# EAGLE schematic A13-OLinuXino-MICRO_Rev_B (EAGLE 6.4)
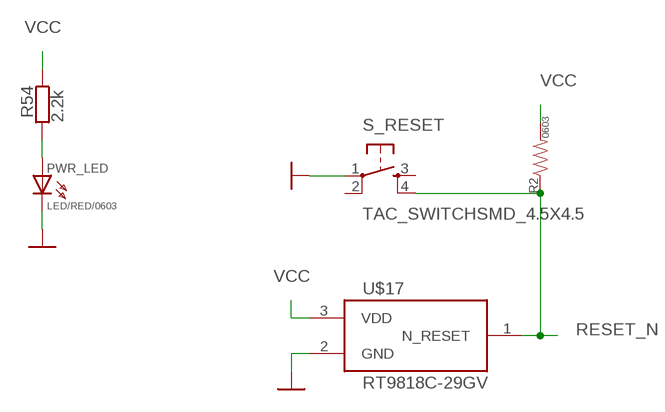
[diagram p0: schematic, sheet 1, part 1 of 3]
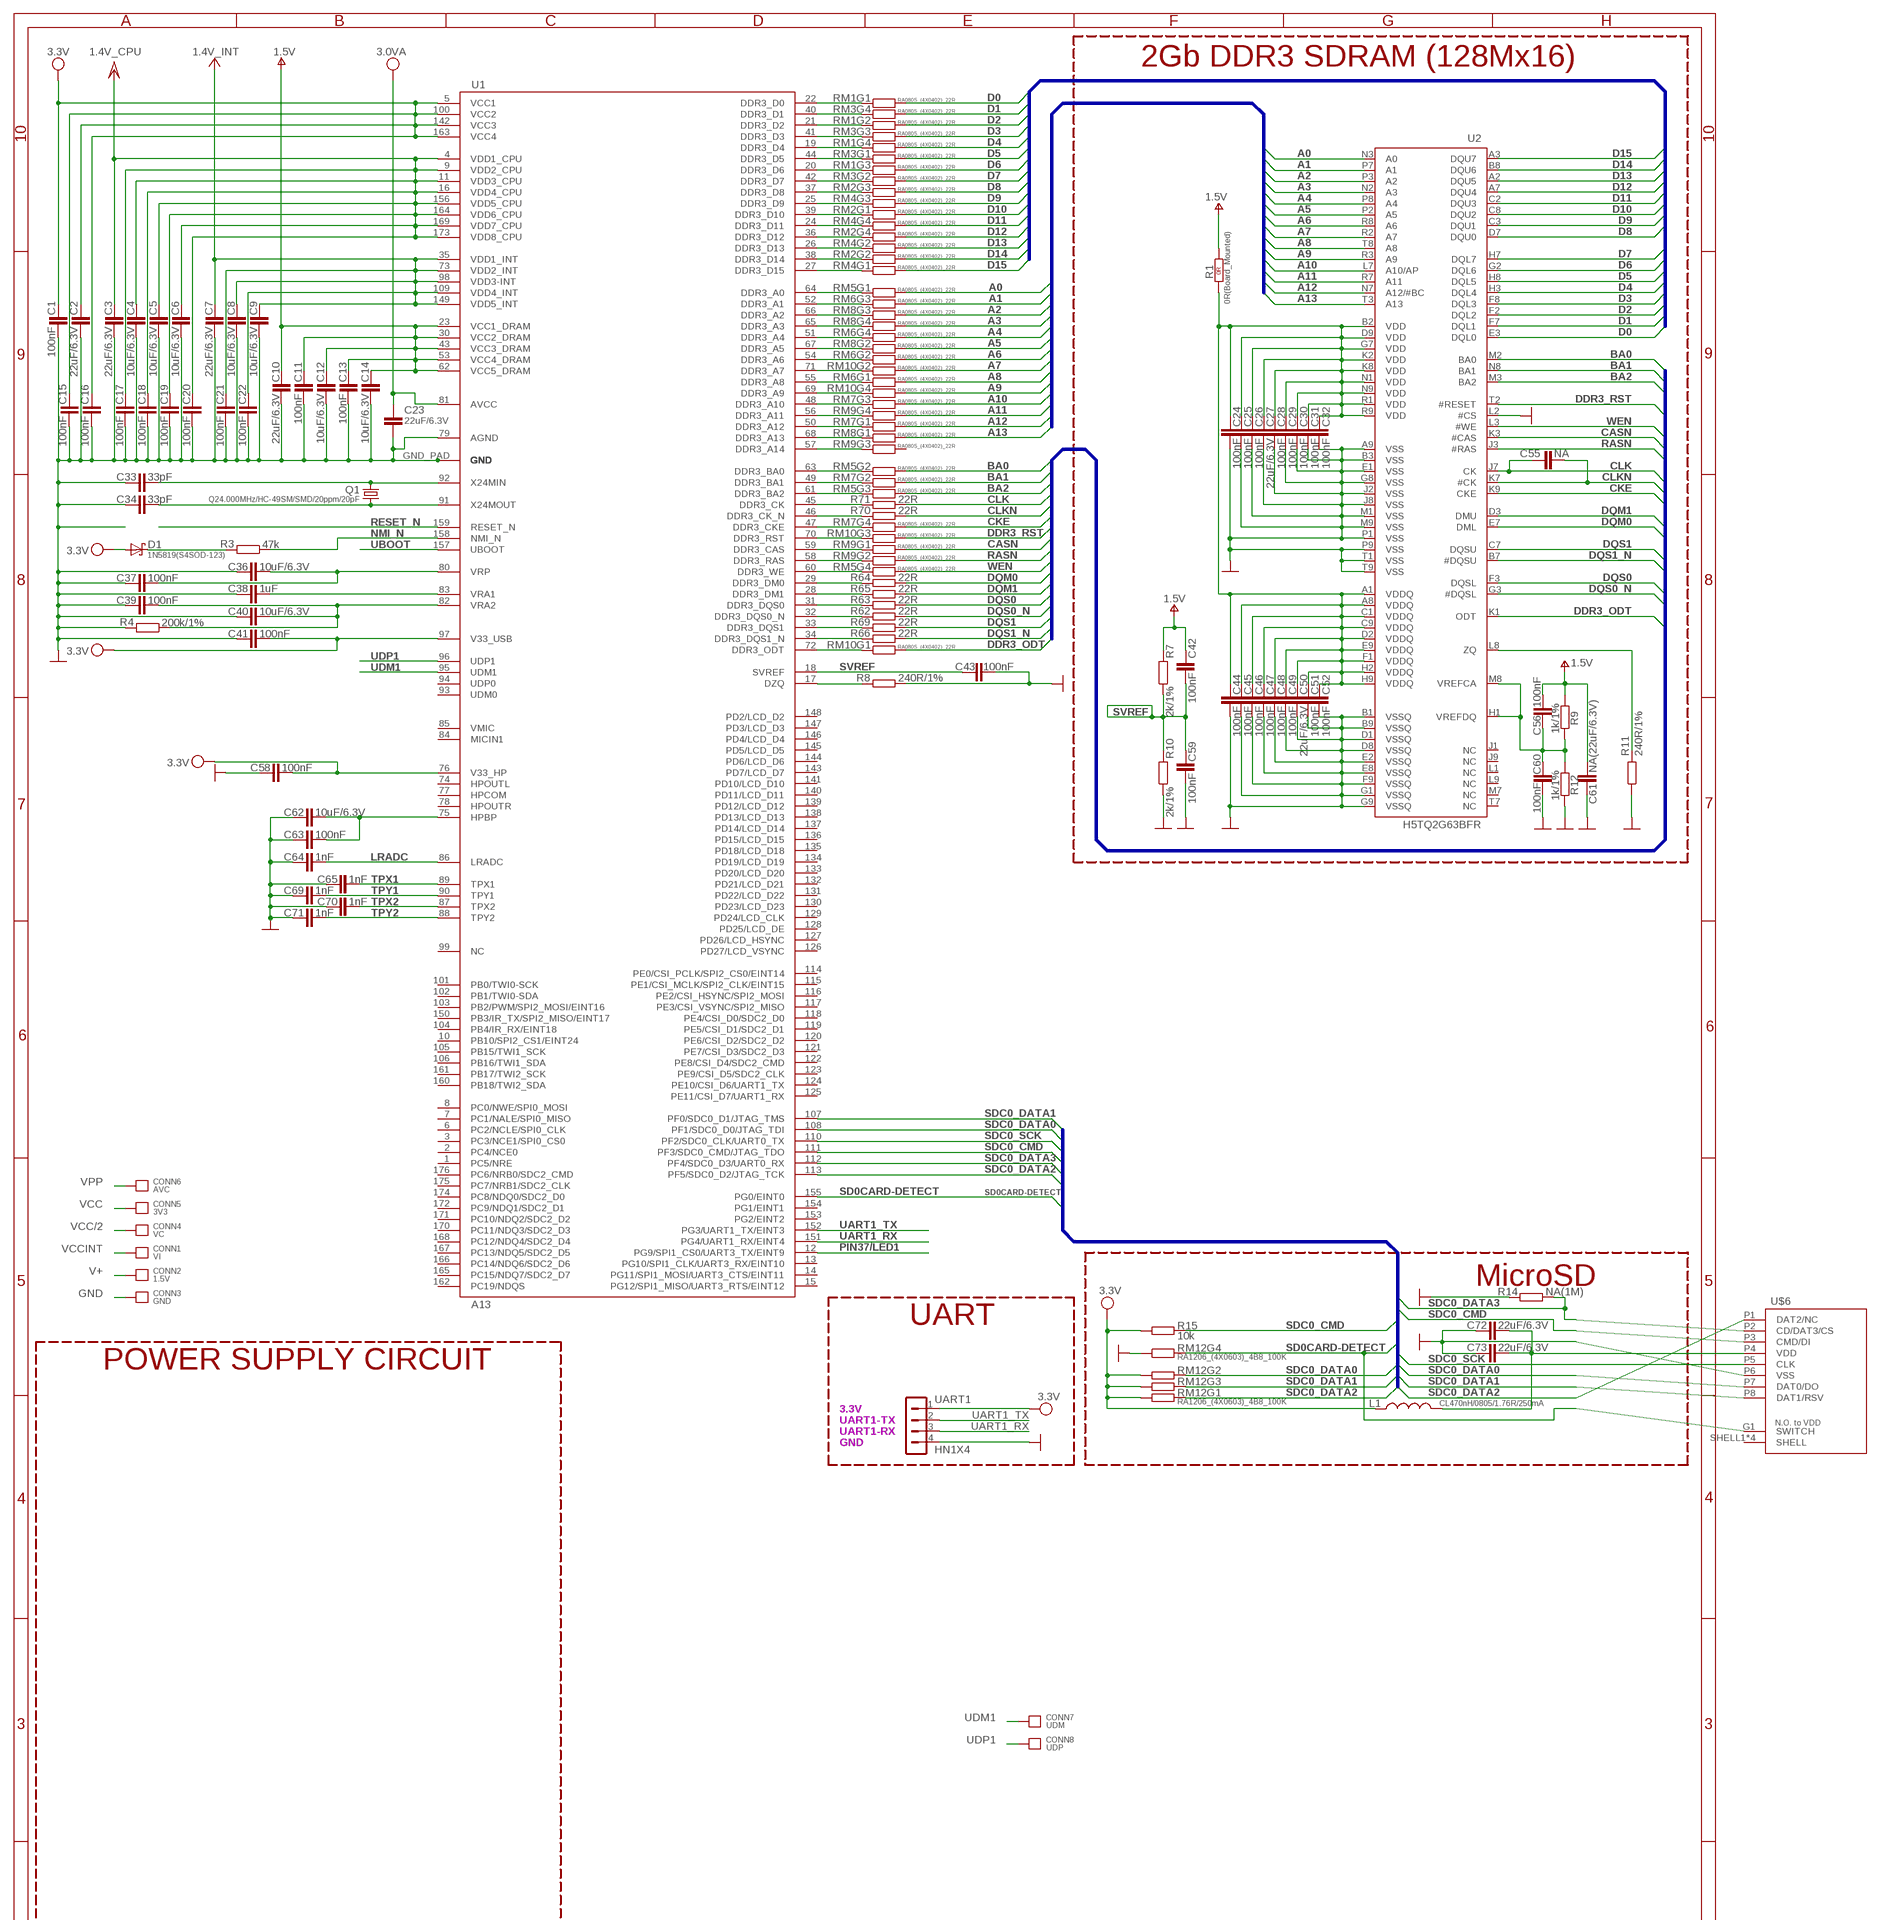
[diagram p1: schematic, sheet 1, part 2 of 3]
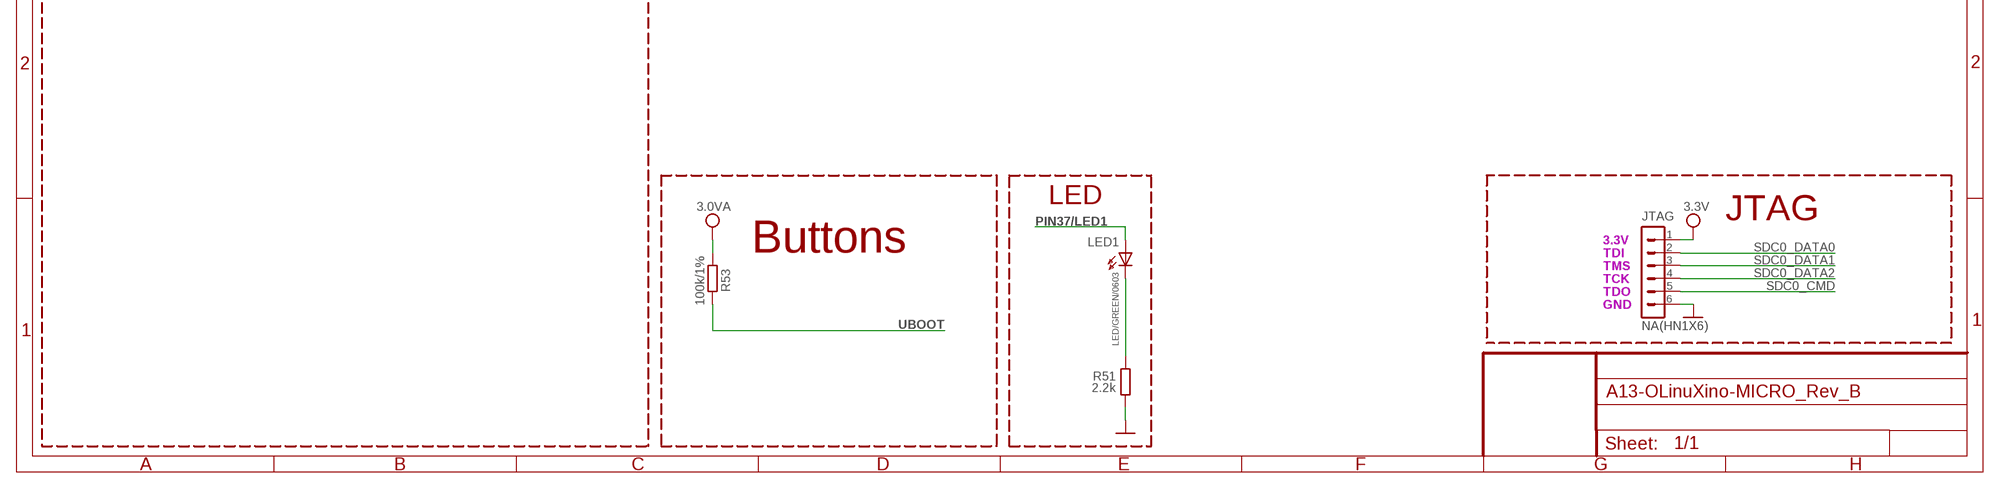
[diagram p2: schematic, sheet 1, part 3 of 3]

## Parts
C1  100nF  C-EUC0402  [C0402]
C2  22uF/6.3V  C-EUC0603_DWS  [C0603_DWS]
C3  22uF/6.3V  C-EUC0603_DWS  [C0603_DWS]
C4  10uF/6.3V  C-EUC0603_DWS  [C0603_DWS]
C5  10uF/6.3V  C-EUC0603_DWS  [C0603_DWS]
C6  10uF/6.3V  C-EUC0603_DWS  [C0603_DWS]
C7  22uF/6.3V  C-EUC0603_DWS  [C0603_DWS]
C8  10uF/6.3V  C-EUC0603_DWS  [C0603_DWS]
C9  10uF/6.3V  C-EUC0603_DWS  [C0603_DWS]
C10  22uF/6.3V  C-EUC0603_DWS  [C0603_DWS]
C11  100nF  C-EUC0402  [C0402]
C12  10uF/6.3V  C-EUC0603_DWS  [C0603_DWS]
C13  100nF  C-EUC0402  [C0402]
C14  10uF/6.3V  C-EUC0603_DWS  [C0603_DWS]
C15  100nF  C-EUC0402  [C0402]
C16  100nF  C-EUC0402  [C0402]
C17  100nF  C-EUC0402  [C0402]
C18  100nF  C-EUC0402  [C0402]
C19  100nF  C-EUC0402  [C0402]
C20  100nF  C-EUC0402  [C0402]
C21  100nF  C-EUC0402  [C0402]
C22  100nF  C-EUC0402  [C0402]
C23  22uF/6.3V  C-EUC0603_DWS  [C0603_DWS]
C24  100nF  C-EUC0402  [C0402]
C25  100nF  C-EUC0402  [C0402]
C26  100nF  C-EUC0402  [C0402]
C27  22uF/6.3V  C-EUC0603_DWS  [C0603_DWS]
C28  100nF  C-EUC0402  [C0402]
C29  100nF  C-EUC0402  [C0402]
C30  100nF  C-EUC0402  [C0402]
C31  100nF  C-EUC0402  [C0402]
C32  100nF  C-EUC0402  [C0402]
C33  33pF  C-EUC0402  [C0402]
C34  33pF  C-EUC0402  [C0402]
C36  10uF/6.3V  C-EUC0603_DWS  [C0603_DWS]
C37  100nF  C-EUC0402  [C0402]
C38  1uF  C-EUC0402  [C0402]
C39  100nF  C-EUC0402  [C0402]
C40  10uF/6.3V  C-EUC0603_DWS  [C0603_DWS]
C41  100nF  C-EUC0402  [C0402]
C42  100nF  C-EUC0402  [C0402]
C43  100nF  C-EUC0402  [C0402]
C44  100nF  C-EUC0402  [C0402]
C45  100nF  C-EUC0402  [C0402]
C46  100nF  C-EUC0402  [C0402]
C47  100nF  C-EUC0402  [C0402]
C48  100nF  C-EUC0402  [C0402]
C49  100nF  C-EUC0402  [C0402]
C50  22uF/6.3V  C-EUC0603_DWS  [C0603_DWS]
C51  100nF  C-EUC0402  [C0402]
C52  100nF  C-EUC0402  [C0402]
C55  NA  C-EUC0603_DWS  [C0603_DWS]
C56  100nF  C-EUC0402  [C0402]
C58  100nF  C-EUC0402  [C0402]
C59  100nF  C-EUC0402  [C0402]
C60  100nF  C-EUC0402  [C0402]
C61  NA(22uF/6.3V)  C-EUC0603_DWS  [C0603_DWS]
C62  10uF/6.3V  C-EUC0603_DWS  [C0603_DWS]
C63  100nF  C-EUC0402  [C0402]
C64  1nF  C-EUC0402  [C0402]
C65  1nF  C-EUC0402  [C0402]
C69  1nF  C-EUC0402  [C0402]
C70  1nF  C-EUC0402  [C0402]
C71  1nF  C-EUC0402  [C0402]
C72  22uF/6.3V  C-EUC0603_DWS  [C0603_DWS]
C73  22uF/6.3V  C-EUC0603_DWS  [C0603_DWS]
CONN1  VI  CONNECTOR22AWG  [HOLE_22AWG]
CONN2  1.5V  CONNECTOR22AWG  [HOLE_22AWG]
CONN3  GND  CONNECTOR22AWG  [HOLE_22AWG]
CONN4  VC  CONNECTOR22AWG  [HOLE_22AWG]
CONN5  3V3  CONNECTOR22AWG  [HOLE_22AWG]
CONN6  AVC  CONNECTOR22AWG  [HOLE_22AWG]
CONN7  UDM  CONNECTOR22AWG  [HOLE_22AWG]
CONN8  UDP  CONNECTOR22AWG  [HOLE_22AWG]
D1  1N5819(S4SOD-123)  SCHOTKKY7.62SS-1N5819(S4SOD-123)  [SOD-123]
JTAG  NA(HN1X6)  CON6HN1X6  [HN1X6]
L1  CL470nH/0805/1.76R/250mA  L-USL0805_5MIL_DWS  [L0805_5MIL_DWS]
LED1  LED/GREEN/0603  LED0603DWS  [LED-0603]
PWR_LED  LED/RED/0603  LED0603DWS  [LED-0603]
Q1  Q24.000MHz/HC-49SM/SMD/20ppm/20pF  HC49/S1  [HC49/SMD2_THIN]
R1  0R(Board_Mounted)  R_0R0R(NA)  [0603_0R]
R2  RESISTOR0603  [0603-RES]
R3  47k  R-EU_R0603_5MIL_DWS  [R0603_5MIL_DWS]
R4  200k/1%  R-EU_R0603_5MIL_DWS  [R0603_5MIL_DWS]
R7  2k/1%  R-EU_R0603_5MIL_DWS  [R0603_5MIL_DWS]
R8  240R/1%  R-EU_R0603_5MIL_DWS  [R0603_5MIL_DWS]
R9  1k/1%  R-EU_R0603_5MIL_DWS  [R0603_5MIL_DWS]
R10  2k/1%  R-EU_R0603_5MIL_DWS  [R0603_5MIL_DWS]
R11  240R/1%  R-EU_R0603_5MIL_DWS  [R0603_5MIL_DWS]
R12  1k/1%  R-EU_R0603_5MIL_DWS  [R0603_5MIL_DWS]
R14  NA(1M)  R-EU_R0603_5MIL_DWS  [R0603_5MIL_DWS]
R15  10k  R-EU_R0603_5MIL_DWS  [R0603_5MIL_DWS]
R51  2.2k  R-EU_R0603_5MIL_DWS  [R0603_5MIL_DWS]
R53  100k/1%  R-EU_R0603_5MIL_DWS  [R0603_5MIL_DWS]
R54  2.2k  R-EU_R0603_5MIL_DWS  [R0603_5MIL_DWS]
R62  22R  R-EU_R0603_5MIL_DWS  [R0603_5MIL_DWS]
R63  22R  R-EU_R0603_5MIL_DWS  [R0603_5MIL_DWS]
R64  22R  R-EU_R0603_5MIL_DWS  [R0603_5MIL_DWS]
R65  22R  R-EU_R0603_5MIL_DWS  [R0603_5MIL_DWS]
R66  22R  R-EU_R0603_5MIL_DWS  [R0603_5MIL_DWS]
R69  22R  R-EU_R0603_5MIL_DWS  [R0603_5MIL_DWS]
R70  22R  R-EU_R0603_5MIL_DWS  [R0603_5MIL_DWS]
R71  22R  R-EU_R0603_5MIL_DWS  [R0603_5MIL_DWS]
RM1  RA0805_(4X0402)_22R  R_MATRIX_4E_25X625  [R_MATRIX_4_0402_25X625]
RM2  RA0805_(4X0402)_22R  R_MATRIX_4E_25X625  [R_MATRIX_4_0402_25X625]
RM3  RA0805_(4X0402)_22R  R_MATRIX_4E_25X625  [R_MATRIX_4_0402_25X625]
RM4  RA0805_(4X0402)_22R  R_MATRIX_4E_25X625  [R_MATRIX_4_0402_25X625]
RM5  RA0805_(4X0402)_22R  R_MATRIX_4E_25X625  [R_MATRIX_4_0402_25X625]
RM6  RA0805_(4X0402)_22R  R_MATRIX_4E_25X625  [R_MATRIX_4_0402_25X625]
RM7  RA0805_(4X0402)_22R  R_MATRIX_4E_25X625  [R_MATRIX_4_0402_25X625]
RM8  RA0805_(4X0402)_22R  R_MATRIX_4E_25X625  [R_MATRIX_4_0402_25X625]
RM9  RA0805_(4X0402)_22R  R_MATRIX_4E_25X625  [R_MATRIX_4_0402_25X625]
RM10  RA0805_(4X0402)_22R  R_MATRIX_4E_25X625  [R_MATRIX_4_0402_25X625]
RM12  RA1206_(4X0603)_4B8_100K  R_MATRIX_4E  [R_MATRIX_4]
S_RESET  TAC_SWITCHSMD_4.5X4.5  [TAC_SWITCH_SMD_4.5X4.5]
U1  A13  [TQFP176]
U2  H5TQ2G63BFR  [FBGA96]
U$6  MICROSDMOLEX-1050270001  [MICROSD-MOLEX-1050270001]
U$17  RT9818C-29GV  POR_ACTIVE_LOW  [SOT23-3]
UART1  HN1X4  CON4HN1X4  [HN1X4]

## Nets
A0: RM5.1.2 U2.N3(A0)
A1: RM6.3.2 U2.P7(A1)
A2: RM8.3.2 U2.P3(A2)
A3: RM8.4.2 U2.N2(A3)
A4: RM6.4.2 U2.P8(A4)
A5: RM8.2.2 U2.P2(A5)
A6: RM6.2.2 U2.R8(A6)
A7: RM10.2.2 U2.R2(A7)
A8: RM6.1.2 U2.T8(A8)
A9: RM10.4.2 U2.R3(A9)
A10: RM7.3.2 U2.L7(A10/AP)
A11: RM9.4.2 U2.R7(A11)
A12: RM7.1.2 U2.N7(A12/#BC)
A13: RM8.1.2 U2.T3(A13)
BA0: RM5.2.2 U2.M2(BA0)
BA1: RM7.2.2 U2.N8(BA1)
BA2: RM5.3.2 U2.M3(BA2)
CASN: RM9.1.2 U2.K3(#CAS)
CKE: RM7.4.2 U2.K9(CKE)
CLK: C55.1 R71.1 U2.J7(CK)
CLKN: C55.2 R70.1 U2.K7(#CK)
D0: RM1.1.2 U2.E3(DQL0)
D1: RM3.4.2 U2.F7(DQL1)
D2: RM1.2.2 U2.F2(DQL2)
D3: RM3.3.2 U2.F8(DQL3)
D4: RM1.4.2 U2.H3(DQL4)
D5: RM3.1.2 U2.H8(DQL5)
D6: RM1.3.2 U2.G2(DQL6)
D7: RM3.2.2 U2.H7(DQL7)
D8: RM2.3.2 U2.D7(DQU0)
D9: RM4.3.2 U2.C3(DQU1)
D10: RM2.1.2 U2.C8(DQU2)
D11: RM4.4.2 U2.C2(DQU3)
D12: RM2.4.2 U2.A7(DQU4)
D13: RM4.2.2 U2.A2(DQU5)
D14: RM2.2.2 U2.B8(DQU6)
D15: RM4.1.2 U2.A3(DQU7)
DDR3_A0: RM5.1.1 U1.64(DDR3_A0)
DDR3_A1: RM6.3.1 U1.52(DDR3_A1)
DDR3_A2: RM8.3.1 U1.66(DDR3_A2)
DDR3_A3: RM8.4.1 U1.65(DDR3_A3)
DDR3_A4: RM6.4.1 U1.51(DDR3_A4)
DDR3_A5: RM8.2.1 U1.67(DDR3_A5)
DDR3_A6: RM6.2.1 U1.54(DDR3_A6)
DDR3_A7: RM10.2.1 U1.71(DDR3_A7)
DDR3_A8: RM6.1.1 U1.55(DDR3_A8)
DDR3_A9: RM10.4.1 U1.69(DDR3_A9)
DDR3_A10: RM7.3.1 U1.48(DDR3_A10)
DDR3_A11: RM9.4.1 U1.56(DDR3_A11)
DDR3_A12: RM7.1.1 U1.50(DDR3_A12)
DDR3_A13: RM8.1.1 U1.68(DDR3_A13)
DDR3_A14: RM9.3.1 U1.57(DDR3_A14)
DDR3_BA0: RM5.2.1 U1.63(DDR3_BA0)
DDR3_BA1: RM7.2.1 U1.49(DDR3_BA1)
DDR3_BA2: RM5.3.1 U1.61(DDR3_BA2)
DDR3_CAS: RM9.1.1 U1.59(DDR3_CAS)
DDR3_CK: R71.2 U1.45(DDR3_CK)
DDR3_CK_N: R70.2 U1.46(DDR3_CK_N)
DDR3_CKE: RM7.4.1 U1.47(DDR3_CKE)
DDR3_D0: RM1.1.1 U1.22(DDR3_D0)
DDR3_D1: RM3.4.1 U1.40(DDR3_D1)
DDR3_D2: RM1.2.1 U1.21(DDR3_D2)
DDR3_D3: RM3.3.1 U1.41(DDR3_D3)
DDR3_D4: RM1.4.1 U1.19(DDR3_D4)
DDR3_D5: RM3.1.1 U1.44(DDR3_D5)
DDR3_D6: RM1.3.1 U1.20(DDR3_D6)
DDR3_D7: RM3.2.1 U1.42(DDR3_D7)
DDR3_D8: RM2.3.1 U1.37(DDR3_D8)
DDR3_D9: RM4.3.1 U1.25(DDR3_D9)
DDR3_D10: RM2.1.1 U1.39(DDR3_D10)
DDR3_D11: RM4.4.1 U1.24(DDR3_D11)
DDR3_D12: RM2.4.1 U1.36(DDR3_D12)
DDR3_D13: RM4.2.1 U1.26(DDR3_D13)
DDR3_D14: RM2.2.1 U1.38(DDR3_D14)
DDR3_D15: RM4.1.1 U1.27(DDR3_D15)
DDR3_DM0: R64.2 U1.29(DDR3_DM0)
DDR3_DM1: R65.2 U1.28(DDR3_DM1)
DDR3_DQS0: R63.2 U1.31(DDR3_DQS0)
DDR3_DQS0_N: R62.2 U1.32(DDR3_DQS0_N)
DDR3_DQS1: R69.2 U1.33(DDR3_DQS1)
DDR3_DQS1_N: R66.2 U1.34(DDR3_DQS1_N)
DDR3_ODT: RM10.1.2 U2.K1(ODT)
DDR3_ODTT: RM10.1.1 U1.72(DDR3_ODT)
DDR3_RAS: RM9.2.1 U1.58(DDR3_RAS)
DDR3_RST: RM10.3.2 U2.T2(#RESET)
DDR3_RSTT: RM10.3.1 U1.70(DDR3_RST)
DDR3_WE: RM5.4.1 U1.60(DDR3_WE)
DQM0: R64.1 U2.E7(DML)
DQM1: R65.1 U2.D3(DMU)
DQS0: R63.1 U2.F3(DQSL)
DQS0_N: R62.1 U2.G3(#DQSL)
DQS1: R69.1 U2.C7(DQSU)
DQS1_N: R66.1 U2.B7(#DQSU)
DZQ: R8.2 U1.17(DZQ)
GND [PWR]: C1.1 C2.1 C3.1 C4.1 C5.1 C6.1 C7.1 C8.1 C9.1 C10.1 C11.1 C12.1 C13.1 C14.1 C15.1 C16.1 C17.1 C18.1 C19.1 C20.1 C21.1 C22.1 C23.1 C24.2 C25.2 C26.2 C27.2 C28.2 C29.2 C30.2 C31.2 C32.2 C33.1 C34.1 C36.1 C37.1 C38.1 C39.1 C40.1 C41.1 C43.1 C44.2 C45.2 C46.2 C47.2 C48.2 C49.2 C50.2 C51.2 C52.2 C58.1 C59.1 C60.1 C61.1 C62.1 C63.1 C64.1 C65.1 C69.1 C70.1 C71.1 C72.1 C73.1 CONN3.P JTAG.6 PWR_LED.C R4.2 R8.1 R10.1 R11.1 R12.1 R14.2 R51.1 RM12.4.1 S_RESET.1 U1.79(AGND) U1.GND_PAD(GND) U1.P$2(GND) U1.P$3(GND) U1.P$4(GND) U1.P$5(GND) U1.P$6(GND) U1.P$7(GND) U1.P$8(GND) U1.P$9(GND) U1.P$10(GND) U1.P$11(GND) U1.P$12(GND) U1.P$13(GND) U1.P$14(GND) U1.P$15(GND) U1.P$16(GND) U1.P$17(GND) U1.P$18(GND) U2.A9(VSS) U2.B1(VSSQ) U2.B3(VSS) U2.B9(VSSQ) U2.D1(VSSQ) U2.D8(VSSQ) U2.E1(VSS) U2.E2(VSSQ) U2.E8(VSSQ) U2.F9(VSSQ) U2.G1(VSSQ) U2.G8(VSS) U2.G9(VSSQ) U2.J2(VSS) U2.J8(VSS) U2.L2(#CS) U2.M1(VSS) U2.M9(VSS) U2.P1(VSS) U2.P9(VSS) U2.T1(VSS) U2.T9(VSS) U$6.P6(VSS) U$17.2(GND) UART1.4
LRADC: C64.2 U1.86(LRADC)
N$1: C62.2 C63.2 U1.75(HPBP)
N$9: C36.2 C37.2 U1.80(VRP)
N$10: D1.C R3.2
N$13: C38.2 U1.83(VRA1)
N$14: C39.2 C40.2 R4.1 U1.82(VRA2)
N$37: C56.2 C60.2 R9.1 R12.2 U2.H1(VREFDQ) U2.M8(VREFCA)
N$42: LED1.C R51.2
N$129: PWR_LED.A R54.2
NMI_N: R3.1 U1.158(NMI_N)
PIN37/LED1 [PWR]: LED1.A U1.12(PG9/SPI1_CS0/UART3_TX/EINT9)
RASN: RM9.2.2 U2.J3(#RAS)
RESET_N: R2.1 S_RESET.4 U1.159(RESET_N) U$17.1(N_RESET)
SD0CARD-DETECT: RM12.4.2 U1.155(PG0/EINT0) U$6.G1(SWITCH)
SD_VCC: C72.2 C73.2 L1.2 U$6.P4(VDD)
SDC0_CMD: JTAG.5 R15.1 U1.111(PF3/SDC0_CMD/JTAG_TDO) U$6.P3(CMD/DI)
SDC0_DATA0: JTAG.2 RM12.2.1 U1.108(PF1/SDC0_D0/JTAG_TDI) U$6.P7(DAT0/DO)
SDC0_DATA1: JTAG.3 RM12.3.1 U1.107(PF0/SDC0_D1/JTAG_TMS) U$6.P8(DAT1/RSV)
SDC0_DATA2: JTAG.4 RM12.1.1 U1.113(PF5/SDC0_D2/JTAG_TCK) U$6.P1(DAT2/NC)
SDC0_DATA3: R14.1 U1.112(PF4/SDC0_D3/UART0_RX) U$6.P2(CD/DAT3/CS)
SDC0_SCK: U1.110(PF2/SDC0_CLK/UART0_TX) U$6.P5(CLK)
SVREF: C42.2 C43.2 C59.2 R7.1 R10.2 U1.18(SVREF)
TPX1: C65.2 U1.89(TPX1)
TPX2: C70.2 U1.87(TPX2)
TPY1: C69.2 U1.90(TPY1)
TPY2: C71.2 U1.88(TPY2)
UART1_RX: U1.151(PG4/UART1_RX/EINT4) UART1.3
UART1_TX: U1.152(PG3/UART1_TX/EINT3) UART1.2
UBOOT: R53.2 U1.157(UBOOT)
UDM1: CONN7.P U1.95(UDM1)
UDP1: CONN8.P U1.96(UDP1)
V+: C10.2 C11.2 C12.2 C13.2 C14.2 C42.1 C56.1 C61.2 CONN2.P R1.1(1.1) R7.2 R9.2 U1.23(VCC1_DRAM) U1.30(VCC2_DRAM) U1.43(VCC3_DRAM) U1.53(VCC4_DRAM) U1.62(VCC5_DRAM) ; supply symbol labelled 1.5V
VCC [PWR]: C1.2 C2.2 C15.2 C16.2 C41.2 C58.2 CONN5.P D1.A JTAG.1 L1.1 R2.2 R15.2 R54.1 RM12.1.2 RM12.2.2 RM12.3.2 U1.5(VCC1) U1.76(V33_HP) U1.97(V33_USB) U1.100(VCC2) U1.142(VCC3) U1.163(VCC4) U$17.3(VDD) UART1.1 ; supply symbol labelled 3.3V
VCC/2: C3.2 C4.2 C5.2 C6.2 C17.2 C18.2 C19.2 C20.2 CONN4.P U1.4(VDD1_CPU) U1.9(VDD2_CPU) U1.11(VDD3_CPU) U1.16(VDD4_CPU) U1.156(VDD5_CPU) U1.164(VDD6_CPU) U1.169(VDD7_CPU) U1.173(VDD8_CPU) ; supply symbol labelled 1.4V_CPU
VCCINT: C7.2 C8.2 C9.2 C21.2 C22.2 CONN1.P U1.35(VDD1_INT) U1.73(VDD2_INT) U1.98(VDD3-INT) U1.109(VDD4_INT) U1.149(VDD5_INT) ; supply symbol labelled 1.4V_INT
VDD.: C24.1 C25.1 C26.1 C27.1 C28.1 C29.1 C30.1 C31.1 C32.1 C44.1 C45.1 C46.1 C47.1 C48.1 C49.1 C50.1 C51.1 C52.1 R1.2(1.2) U2.A1(VDDQ) U2.A8(VDDQ) U2.B2(VDD) U2.C1(VDDQ) U2.C9(VDDQ) U2.D2(VDDQ) U2.D9(VDD) U2.E9(VDDQ) U2.F1(VDDQ) U2.G7(VDD) U2.H2(VDDQ) U2.H9(VDDQ) U2.K2(VDD) U2.K8(VDD) U2.N1(VDD) U2.N9(VDD) U2.R1(VDD) U2.R9(VDD)
VPP [PWR]: C23.2 CONN6.P R53.1 U1.81(AVCC) ; supply symbol labelled 3.0VA
WEN: RM5.4.2 U2.L3(#WE)
XTALI: C33.2 Q1.2 U1.92(X24MIN)
XTALO: C34.2 Q1.1 U1.91(X24MOUT)
ZQ: R11.2 U2.L8(ZQ)
Unconnected: RM9.3.2 S_RESET.2 S_RESET.3 U1.1(PC5/NRE) U1.2(PC4/NCE0) U1.3(PC3/NCE1/SPI0_CS0) U1.6(PC2/NCLE/SPI0_CLK) U1.7(PC1/NALE/SPI0_MISO) U1.8(PC0/NWE/SPI0_MOSI) U1.10(PB10/SPI2_CS1/EINT24) U1.13(PG10/SPI1_CLK/UART3_RX/EINT10) U1.14(PG11/SPI1_MOSI/UART3_CTS/EINT11) U1.15(PG12/SPI1_MISO/UART3_RTS/EINT12) U1.74(HPOUTL) U1.77(HPCOM) U1.78(HPOUTR) U1.84(MICIN1) U1.93(UDM0) U1.94(UDP0) U1.99(NC) U1.101(PB0/TWI0-SCK) U1.102(PB1/TWI0-SDA) U1.103(PB2/PWM/SPI2_MOSI/EINT16) U1.104(PB4/IR_RX/EINT18) U1.105(PB15/TWI1_SCK) U1.106(PB16/TWI1_SDA) U1.114(PE0/CSI_PCLK/SPI2_CS0/EINT14) U1.115(PE1/CSI_MCLK/SPI2_CLK/EINT15) U1.116(PE2/CSI_HSYNC/SPI2_MOSI) U1.117(PE3/CSI_VSYNC/SPI2_MISO) U1.118(PE4/CSI_D0/SDC2_D0) U1.119(PE5/CSI_D1/SDC2_D1) U1.120(PE6/CSI_D2/SDC2_D2) U1.121(PE7/CSI_D3/SDC2_D3) U1.122(PE8/CSI_D4/SDC2_CMD) U1.123(PE9/CSI_D5/SDC2_CLK) U1.124(PE10/CSI_D6/UART1_TX) U1.125(PE11/CSI_D7/UART1_RX) U1.126(PD27/LCD_VSYNC) U1.127(PD26/LCD_HSYNC) U1.128(PD25/LCD_DE) U1.129(PD24/LCD_CLK) U1.130(PD23/LCD_D23) U1.131(PD22/LCD_D22) U1.132(PD21/LCD_D21) U1.133(PD20/LCD_D20) U1.134(PD19/LCD_D19) U1.135(PD18/LCD_D18) U1.136(PD15/LCD_D15) U1.137(PD14/LCD_D14) U1.138(PD13/LCD_D13) U1.139(PD12/LCD_D12) U1.140(PD11/LCD_D11) U1.141(PD10/LCD_D10) U1.143(PD7/LCD_D7) U1.144(PD6/LCD_D6) U1.145(PD5/LCD_D5) U1.146(PD4/LCD_D4) U1.147(PD3/LCD_D3) U1.148(PD2/LCD_D2) U1.150(PB3/IR_TX/SPI2_MISO/EINT17) U1.153(PG2/EINT2) U1.154(PG1/EINT1) U1.160(PB18/TWI2_SDA) U1.161(PB17/TWI2_SCK) U1.162(PC19/NDQS) U1.165(PC15/NDQ7/SDC2_D7) U1.166(PC14/NDQ6/SDC2_D6) U1.167(PC13/NDQ5/SDC2_D5) U1.168(PC12/NDQ4/SDC2_D4) U1.170(PC11/NDQ3/SDC2_D3) U1.171(PC10/NDQ2/SDC2_D2) U1.172(PC9/NDQ1/SDC2_D1) U1.174(PC8/NDQ0/SDC2_D0) U1.175(PC7/NRB1/SDC2_CLK) U1.176(PC6/NRB0/SDC2_CMD) U2.J1(NC) U2.J9(NC) U2.L1(NC) U2.L9(NC) U2.M7(NC) U2.T7(NC) U$6.SHELL1(SHELL) U$6.SHELL2(SHELL) U$6.SHELL3(SHELL) U$6.SHELL4(SHELL)

## Buses
A[0..13]
D[0..15]
SDC0_SCK,SDC0_CMD,SDC0_DATA[0..3],SD0CARD-DETECT
BA[0..2],CLK,CLKN,CKE,CS,CASN,RASN,WEN,DQM[0..1],DQS[0..1],DQS0_N,DQS1_N,DDR3_RST,DDR3_ODT

## Notes on the sheet
- 2Gb DDR3 SDRAM (128Mx16)
- MicroSD
- UART
- POWER SUPPLY CIRCUIT
- 3.3V
- UART1-TX
- UART1-RX
- GND
- LED
- JTAG
- 3.3V
- Buttons
- TDI
- TMS
- TCK
- TDO
- GND

## Power pins joined to a net without a drawn wire
VMIC: U1.85(VMIC)

## Library data of the parts
C1-C34 C36-C52 C55 C56 C58-C65 C69-C73 = rcl:C-EU: CAPACITOR, European symbol
CONN1-CONN8 = kmod-nonparts:CONNECTOR: Collection of holes/pads for testing/connecting
D1 = gogo:SCHOTKKY7.62SS
JTAG = Penko:CON6: CONNECTORS - 6 PINS
L1 = rcl:L-US: INDUCTOR, American symbol
LED1 PWR_LED = DOUBLE-SIDE:LED
Q1 = crystal:HC49/S: CRYSTAL
R1 = OLIMEX_DISCRET:R_0R
R2 = kmod-passives:RESISTOR: Resistor Basic schematic elements and footprints for 0603, 1206, and PTH resistors.; PACKAGE: 0603
R3 R4 R7-R12 R14 R15 R51 R53 R54 R62-R66 R69-R71 = rcl:R-EU_: RESISTOR, European symbol
RM1-RM10 RM12 = OLIMEX_DISCRET:R_MATRIX_4E
S_RESET = kmod-mechanical:TAC_SWITCH: Momentary Switch Button commonly used for reset or general input. Spark Fun Electronics SKU : COM-00097 SMT- SWCH-08247
U1 = OLIMEX_IC:A13
U2 = OLIMEX_IC:H5TQ2G63BFR
U$6 = kmod-connectors:MICROSD; SWITCH_TYPE: N.O. to VDD
U$17 = kmod-ics:POR_ACTIVE_LOW: Power-on-reset unit with active-low reset. Make sure to check the pinouts -- there doesn't seem to be a standard one.
UART1 = Penko:CON4